# Altium schematic sheet downlinkSMDConnector.SchDoc
size 297 x 209 mm
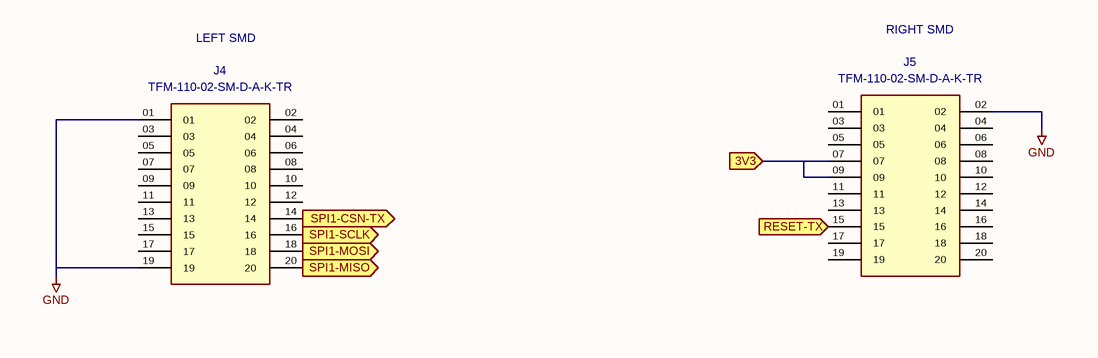
[diagram p0: downlinkSMDConnector.SchDoc]

## Parts
J4  TFM-110-02-SM-D-A-K-TR  [SAMTEC_TFM-110-02-SM-D-A-K-TR]
J5  TFM-110-02-SM-D-A-K-TR  [SAMTEC_TFM-110-02-SM-D-A-K-TR]

## Ports
3V3 (in), RESET-TX (in), SPI1-CSN-TX (in), SPI1-MISO (out), SPI1-MOSI (in), SPI1-SCLK (in)

## Nets
GND: J4.01 J4.19 J5.02
3V3: J5.07 J5.09 ; port 3V3
RESET-TX: J5.15 ; port RESET-TX
SPI1-CSN-TX: J4.14 ; port SPI1-CSN-TX
SPI1-MISO: J4.20 ; port SPI1-MISO
SPI1-MOSI: J4.18 ; port SPI1-MOSI
SPI1-SCLK: J4.16 ; port SPI1-SCLK

Not connected (* = marked no-connect by the designer): J4 02 03 04 05 06 07 08 09 10 11 12 13 15 17; J5 01 03 04 05 06 08 10 11 12 13 14 16 17 18 19 20

## Notes on the sheet
- LEFT SMD
- RIGHT SMD
- 1
- 2
- 3
- 4
- 5
- 6
- A
- B
- C
- D
- Title:
- File: downlinkSMDConnector.kicad_sch
- Sheet: /
- KiCad E.D.A.  kicad (5.1.4)-1
- Size: A4
- Date:
- Rev:
- Id: 1/1

## Library data of the parts
J4 J5 = TFM-110-02-SM-D-A-K-TR: MANUFACTURER: Samtec; STANDARD: Manufacturer Recommendations; PARTREV: R; Value: TFM-110-02-SM-D-A-K-TR